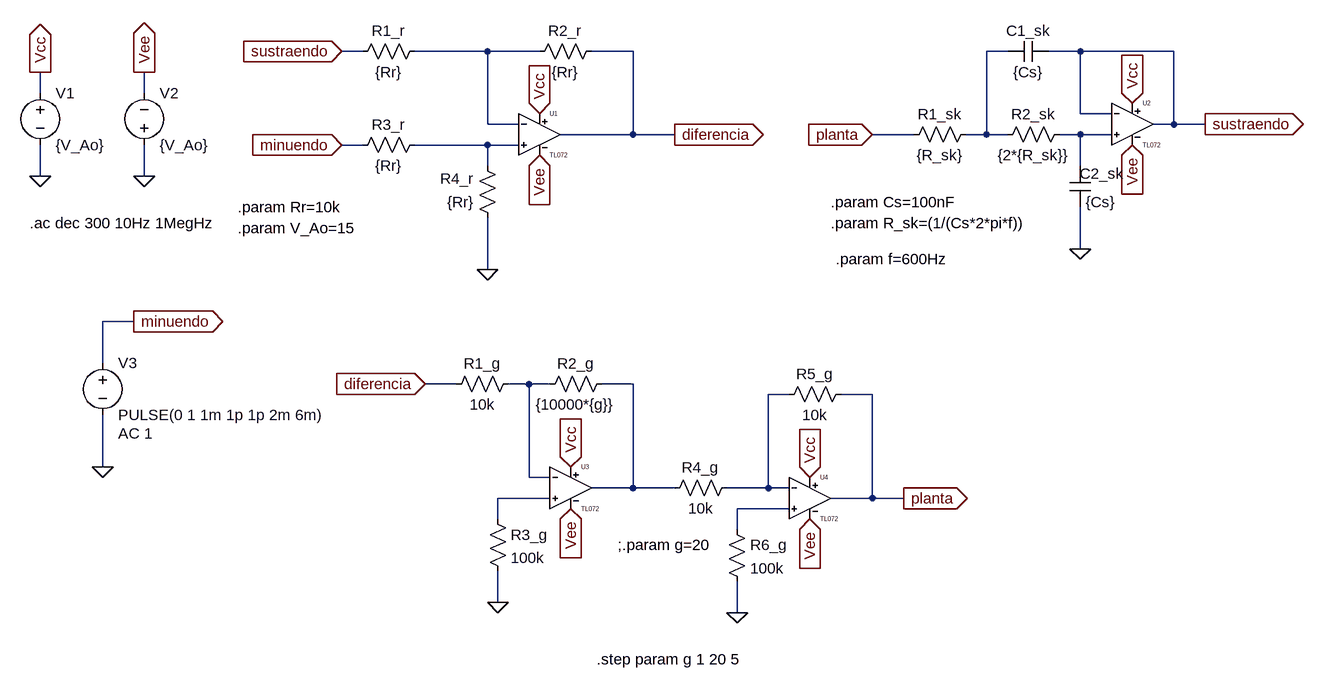
[diagram p0: schematic lazo_sk_bode.asc]
lazo_sk_bode.asc, the LTspice schematic file:
Version 4
SHEET 1 1676 824
WIRE 192 -128 160 -128
WIRE 384 -128 272 -128
WIRE 464 -128 384 -128
WIRE 608 -128 544 -128
WIRE 1184 -128 1152 -128
WIRE 1296 -128 1248 -128
WIRE 1440 -128 1296 -128
WIRE -304 -64 -304 -96
WIRE -144 -64 -144 -96
WIRE 1296 -32 1296 -128
WIRE 1344 -32 1296 -32
WIRE 384 -16 384 -128
WIRE 432 -16 384 -16
WIRE 1440 -16 1440 -128
WIRE 1440 -16 1408 -16
WIRE 1488 -16 1440 -16
WIRE 608 0 608 -128
WIRE 608 0 496 0
WIRE 672 0 608 0
WIRE 1040 0 976 0
WIRE 1152 0 1152 -128
WIRE 1152 0 1120 0
WIRE 1184 0 1152 0
WIRE 1296 0 1264 0
WIRE 1344 0 1296 0
WIRE 192 16 160 16
WIRE 384 16 272 16
WIRE 432 16 384 16
WIRE 384 48 384 16
WIRE 1296 48 1296 0
WIRE -304 64 -304 16
WIRE -144 64 -144 16
WIRE 1296 176 1296 112
WIRE 384 208 384 128
WIRE -160 288 -208 288
WIRE -208 352 -208 288
WIRE 336 384 288 384
WIRE 448 384 416 384
WIRE 480 384 448 384
WIRE 608 384 560 384
WIRE 848 400 816 400
WIRE 976 400 928 400
WIRE -208 512 -208 432
WIRE 448 528 448 384
WIRE 480 528 448 528
WIRE 608 544 608 384
WIRE 608 544 544 544
WIRE 672 544 608 544
WIRE 816 544 816 400
WIRE 816 544 752 544
WIRE 848 544 816 544
WIRE 480 560 400 560
WIRE 976 560 976 400
WIRE 976 560 912 560
WIRE 1024 560 976 560
WIRE 848 576 768 576
WIRE 400 592 400 560
WIRE 768 608 768 576
WIRE 400 720 400 672
WIRE 768 736 768 688
FLAG 464 -32 Vcc
IOPIN 464 -32 In
FLAG 464 32 Vee
IOPIN 464 32 In
FLAG -304 64 0
FLAG -144 64 0
FLAG -144 -96 Vee
IOPIN -144 -96 Out
FLAG -304 -96 Vcc
IOPIN -304 -96 Out
FLAG 384 208 0
FLAG 160 -128 sustraendo
IOPIN 160 -128 In
FLAG 160 16 minuendo
IOPIN 160 16 In
FLAG 672 0 diferencia
IOPIN 672 0 Out
FLAG 1376 -48 Vcc
IOPIN 1376 -48 In
FLAG 1376 16 Vee
IOPIN 1376 16 In
FLAG 1296 176 0
FLAG 1488 -16 sustraendo
IOPIN 1488 -16 Out
FLAG 512 512 Vcc
IOPIN 512 512 In
FLAG 512 576 Vee
IOPIN 512 576 In
FLAG 400 720 0
FLAG 880 528 Vcc
IOPIN 880 528 In
FLAG 880 592 Vee
IOPIN 880 592 In
FLAG 768 736 0
FLAG 288 384 diferencia
IOPIN 288 384 In
FLAG 1024 560 planta
IOPIN 1024 560 Out
FLAG 976 0 planta
IOPIN 976 0 In
FLAG -208 512 0
FLAG -160 288 minuendo
IOPIN -160 288 Out
SYMBOL Opamps\\TL072 464 -64 R0
SYMATTR InstName U1
SYMBOL voltage -304 -80 R0
SYMATTR InstName V1
SYMATTR Value {V_Ao}
SYMBOL voltage -144 32 M180
WINDOW 0 24 96 Left 2
WINDOW 3 24 16 Left 2
SYMATTR InstName V2
SYMATTR Value {V_Ao}
SYMBOL res 288 -144 R90
WINDOW 0 0 56 VBottom 2
WINDOW 3 32 56 VTop 2
SYMATTR InstName R1_r
SYMATTR Value {Rr}
SYMBOL res 560 -144 R90
WINDOW 0 0 56 VBottom 2
WINDOW 3 32 56 VTop 2
SYMATTR InstName R2_r
SYMATTR Value {Rr}
SYMBOL res 288 0 R90
WINDOW 0 0 56 VBottom 2
WINDOW 3 32 56 VTop 2
SYMATTR InstName R3_r
SYMATTR Value {Rr}
SYMBOL res 400 144 R180
WINDOW 0 36 76 Left 2
WINDOW 3 36 40 Left 2
SYMATTR InstName R4_r
SYMATTR Value {Rr}
SYMBOL res 1136 -16 R90
WINDOW 0 0 56 VBottom 2
WINDOW 3 32 56 VTop 2
SYMATTR InstName R1_sk
SYMATTR Value {R_sk}
SYMBOL res 1280 -16 R90
WINDOW 0 0 56 VBottom 2
WINDOW 3 32 56 VTop 2
SYMATTR InstName R2_sk
SYMATTR Value {2*{R_sk}}
SYMBOL cap 1280 48 R0
WINDOW 0 15 12 Left 2
SYMATTR InstName C2_sk
SYMATTR Value {Cs}
SYMBOL Opamps\\TL072 1376 -80 R0
SYMATTR InstName U2
SYMBOL cap 1248 -144 R90
WINDOW 0 0 32 VBottom 2
WINDOW 3 32 32 VTop 2
SYMATTR InstName C1_sk
SYMATTR Value {Cs}
SYMBOL Opamps\\TL072 512 480 R0
SYMATTR InstName U3
SYMBOL res 576 368 R90
WINDOW 0 0 56 VBottom 2
WINDOW 3 32 56 VTop 2
SYMATTR InstName R2_g
SYMATTR Value {10000*{g}}
SYMBOL res 384 576 R0
SYMATTR InstName R3_g
SYMATTR Value 100k
SYMBOL Opamps\\TL072 880 496 R0
SYMATTR InstName U4
SYMBOL res 944 384 R90
WINDOW 0 0 56 VBottom 2
WINDOW 3 32 56 VTop 2
SYMATTR InstName R5_g
SYMATTR Value 10k
SYMBOL res 752 592 R0
SYMATTR InstName R6_g
SYMATTR Value 100k
SYMBOL res 768 528 R90
WINDOW 0 0 56 VBottom 2
WINDOW 3 32 56 VTop 2
SYMATTR InstName R4_g
SYMATTR Value 10k
SYMBOL res 432 368 R90
WINDOW 0 0 56 VBottom 2
WINDOW 3 32 56 VTop 2
SYMATTR InstName R1_g
SYMATTR Value 10k
SYMBOL voltage -208 336 R0
WINDOW 123 24 124 Left 2
WINDOW 39 0 0 Left 0
SYMATTR InstName V3
SYMATTR Value PULSE(0 1 1m 1p 1p 2m 6m)
SYMATTR Value2 AC 1
TEXT 0 112 Left 2 !.param Rr=10k
TEXT 0 144 Left 2 !.param V_Ao=15
TEXT 912 104 Left 2 !.param Cs=100nF
TEXT 912 136 Left 2 !.param R_sk=(1/(Cs*2*pi*f))
TEXT 920 192 Left 2 !.param f=600Hz
TEXT 584 632 Left 2 !;.param g=20
TEXT -320 136 Left 2 !.ac dec 300 10Hz 1MegHz
TEXT 552 808 Left 2 !.step param g 1 20 5

The netlist it stands for:
* lazo_sk_bode.asc
XU1 N004 N001 Vcc Vee diferencia TL072  ; pins In+ In- V+ V- OUT
V1 Vcc 0 {V_Ao}
V2 0 Vee {V_Ao}
R1_r N001 sustraendo {Rr}
R2_r diferencia N001 {Rr}
R3_r N004 minuendo {Rr}
R4_r 0 N004 {Rr}
R1_sk N002 planta {R_sk}
R2_sk N003 N002 {2*{R_sk}}
C2_sk N003 0 {Cs}
XU2 N003 sustraendo Vcc Vee sustraendo TL072  ; pins In+ In- V+ V- OUT
C1_sk sustraendo N002 {Cs}
XU3 N008 N005 Vcc Vee N006 TL072  ; pins In+ In- V+ V- OUT
R2_g N006 N005 {10000*{g}}
R3_g N008 0 100k
XU4 N009 N007 Vcc Vee planta TL072  ; pins In+ In- V+ V- OUT
R5_g planta N007 10k
R6_g N009 0 100k
R4_g N007 N006 10k
R1_g N005 diferencia 10k
V3 minuendo 0 PULSE(0 1 1m 1p 1p 2m 6m) AC 1
.param Rr=10k
.param V_Ao=15
.param Cs=100nF
.param R_sk=(1/(Cs*2*pi*f))
.param f=600Hz
;.param g=20
.ac dec 300 10Hz 1MegHz
.step param g 1 20 5
.lib TL072.sub
.backanno
.end